# Altium schematic sheet SynchConv_sch.SchDoc: Synchronous Converter
size A4; Author: Matteo Sposito; CompanyName: ePEBBs; Organization: Altium Limited; Address1: L3, 12a Rodborough Rd; Address2: Frenchs Forest; Address3: NSW; Address4: Australia 2086; DocumentNumber: #1; Revision: v0; SheetNumber: 1; SheetTotal: 1
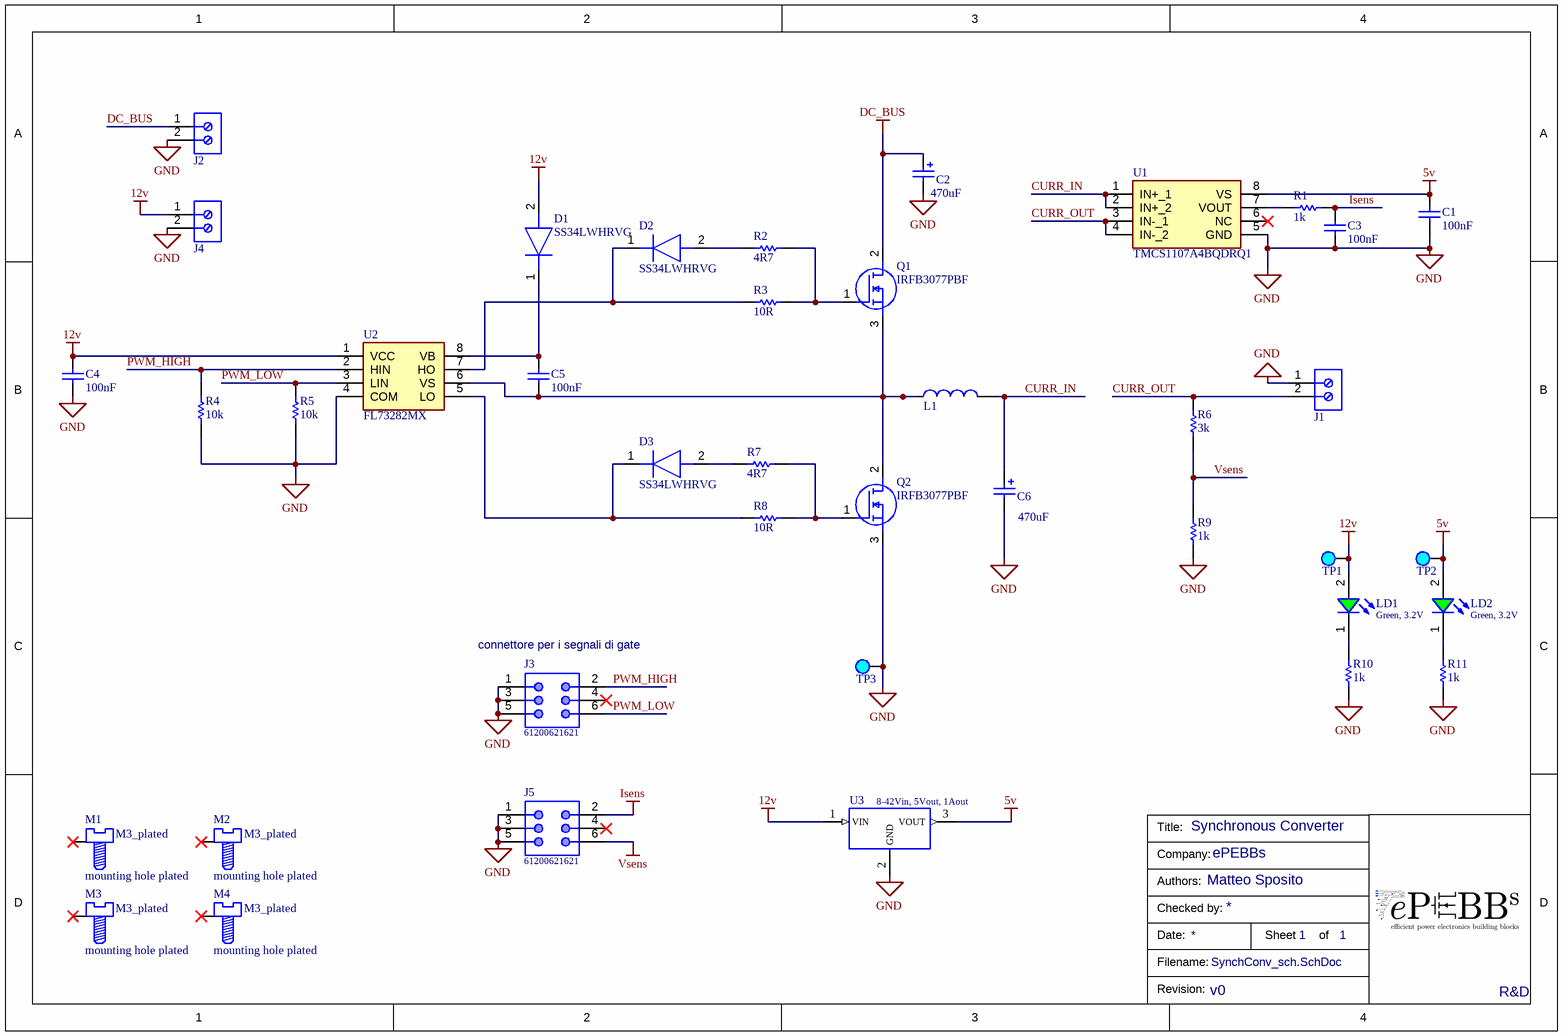
[diagram p0: SynchConv_sch.SchDoc]

## Parts
C1  100nF  [CAP_0805]
C2  470uF  [WCAP-ATG5_D13H20]
C3  100nF  [CAP_0805]
C4  100nF  [CAP_0805]
C5  100nF  [CAP_0805]
C6  470uF  [WCAP-ATG5_D13H20]
D1  SS34LWHRVG  [SODFL3718X102N]
D2  SS34LWHRVG  [SODFL3718X102N]
D3  SS34LWHRVG  [SODFL3718X102N]
J1  691502710002  [691502710002]  (value not drawn)
J2  691502710002  [691502710002]  (value not drawn)
J3  61200621621  [61200621621]
J4  691502710002  [691502710002]  (value not drawn)
J5  61200621621  [61200621621]
L1  59µH, 5.4A  [744134]  (value not drawn)
LD1  Green, 3.2V  [WL-SMCW_0805]
LD2  Green, 3.2V  [WL-SMCW_0805]
M1  mounting hole plated  [M3_Mountingholes plated]
M2  mounting hole plated  [M3_Mountingholes plated]
M3  mounting hole plated  [M3_Mountingholes plated]
M4  mounting hole plated  [M3_Mountingholes plated]
Q1  IRFB3077PBF  [TO254P483X1016X1994-3P]
Q2  IRFB3077PBF  [TO254P483X1016X1994-3P]
R1  1k  [Res_0805]
R2  4R7  [Res_0805]
R3  10R  [Res_0805]
R4  10k  [Res_0805]
R5  10k  [Res_0805]
R6  3k  [Res_0805]
R7  4R7  [Res_0805]
R8  10R  [Res_0805]
R9  1k  [Res_0805]
R10  1k  [Res_0805]
R11  1k  [Res_0805]
TP1  TP_big  [TP_big]  (value not drawn)
TP2  TP_big  [TP_big]  (value not drawn)
TP3  TP_big  [TP_big]  (value not drawn)
U1  TMCS1107A4BQDRQ1  [SOIC127P600X175-8N]
U2  FL73282MX  [SOIC127P600X175-8N]
U3  8-42Vin, 5Vout, 1Aout  [173010x35]

## Nets
5v: C1.2 LD2.2(A) TP2.1 U1.8(VS) U3.3(VOUT)
12v: C4.2 D1.2(A) J4.1 LD1.2(A) TP1.1 U2.1(VCC) U3.1(VIN)
DC_BUS: C2.1(P) J2.1 Q1.2(D)
GND: C1.1 C2.2(N) C3.1 C4.1 C6.2(N) J1.1 J2.2 J3.1 J3.3 J3.5 J4.2 J5.1 J5.3 J5.5 Q2.3(S) R4.1 R5.1 R9.2 R10.1 R11.1 TP3.1 U1.5(GND) U2.4(COM) U3.2(GND)
Isens: C3.2 J5.2 R1.1
Vsens: J5.6 R6.2 R9.1
CURR_IN: C6.1(P) L1.2 U1.1(IN+_1) U1.2(IN+_2)
CURR_OUT: J1.2 R6.1 U1.3(IN-_1) U1.4(IN-_2)
PWM_HIGH: J3.2 R4.2 U2.2(HIN)
PWM_LOW: J3.6 R5.2 U2.3(LIN)
NetC5_1: C5.1 L1.1 Q1.3(S) Q2.2(D) U2.6(VS)
NetC5_2: C5.2 D1.1(K) U2.8(VB)
NetD2_1: D2.1(K) R3.2 U2.7(HO)
NetD2_2: D2.2(A) R2.1
NetD3_1: D3.1(K) R8.2 U2.5(LO)
NetD3_2: D3.2(A) R7.1
NetLD1_1: LD1.1(K) R10.2
NetLD2_1: LD2.1(K) R11.2
NetQ1_1: Q1.1(G) R2.2 R3.1
NetQ2_1: Q2.1(G) R7.2 R8.1
NetR1_2: R1.2 U1.7(VOUT)

Not connected (* = marked no-connect by the designer): J3 4*; J5 4*; M1 1*; M2 1*; M3 1*; M4 1*; U1 6(NC)*

## Notes on the sheet
- (near J3) connettore per i segnali di gate
- Title:
- Checked by:
- Company:
- Authors:
- Date:
- Filename:
- Sheet
- of
- Revision:
- R&D
- (in symbol M3_MountungHole_plated) M3_plated

## Library data of the parts
C1 C3-C5 = Cap_0805: capacitor 0805; Manufacturer Part Number: 885012207098; Manufacturer: Wurth Elektronik; Rated Voltage: 50VDC; Isolation Resistance: >=5GOhm; Ceramic Type: X7R; Capacitance Tolerance: +/-10%; Technical Reference: X7R0805104K050DFCT10000; ComponentLink1Description: Manufacturer; ComponentLink1URL: http://www.we-online.de; ComponentLink2Description: Datasheet; ComponentLink2URL: https://www.we-online.com/catalog/datasheet/885012207098.pdf; Operating Temperature: -55 to +125degC; Packaging: Tape and Reel; Published Date: May 2020; Dissipation Factor: =<2.5%; Height: 0.8mm; Mounting Technology: SMT; Size: 0805; Capacitance: 100nF
C2 C6 = 860020778021: WCAP-ATG5 Aluminum Electrolytic Capacitor, Radial THT, D13xH20mm, 470uF, 63V; Manufacturer: Wurth Elektronik; Capacitance Tolerance: +/-20%; Dissipation Factor: 9%; Endurance: 2000h; Leakage Current: 296.1uA; Ripple Current: 690mA; Technical Reference: ATDI200471M063DSPACB000; ComponentLink1Description: Manufacturer Link; ComponentLink1URL: https://www.we-online.com/redexpert/article/860020778021?ad; ComponentLink2Description: Datasheet; ComponentLink2URL: https://www.we-online.com/redexpert/spec/860020778021?ad; Category: Aluminum Electrolytic Capacitors; Match Code: WCAP-ATG5; Manufacturer Part Number: 860020778021; Mount: Through Hole; Operating Temperature Max: 105°C; Operating Temperature Min: -40°C; Packaging: Ammo Pack; Height: 20mm; Diameter: 13mm; Capacitance: 470uF; Rated Voltage (DC): 63V
D1-D3 = SS34LWHRVG: Diode; Manufacturer_Name: Taiwan Semiconductor; Datasheet Link: https://datasheet.datasheetarchive.com/originals/distributors/DKDS-20/389381.pdf; Height: 1.02mm; Manufacturer_Part_Number: SS34LWHRVG; Mouser Part Number: 821-SS34LWHRVG; Mouser Price/Stock: https://www.mouser.co.uk/ProductDetail/Taiwan-Semiconductor/SS34LWHRVG?qs=5aG0NVq1C4zYvYQjFNyRbA%3D%3D; Arrow Part Number: SS34LWHRVG; Arrow Price/Stock: https://www.arrow.com/en/products/ss34lwhrvg/taiwan-semiconductor?region=nac
J1 J2 J4 = 691502710002: WR-TBL Series 5027 Horizontal Entry Modular, Through Hole, pitch 5mm, 2p; Manufacturer: Wurth Elektronik; Pin Number: 2; Rated Current: 15A; Working Voltage: 300V; PCB/Cable/Panel: PCB; Modularity: Yes; ComponentLink1Description: Manufacturer Link; ComponentLink1URL: https://www.we-online.com/redexpert/article/691502710002?ad; ComponentLink2Description: Datasheet; ComponentLink2URL: https://www.we-online.com/redexpert/spec/691502710002?ad; Category: Terminal Blocks; Match Code: WR-TBL; Manufacturer Part Number: 691502710002; Mount: Through Hole; Operating Temperature Max: 130°C; Operating Temperature Min: -40°C; Packaging: Box; Pitch: 5mm; Orientation: Horizontal; Application: Pressure Clamp
J3 J5 = 61200621621: WR-BHD Box Header, Male PCB side, pitch 2.54mm, THT, Straight, 6p; Manufacturer: Wurth Elektronik; Working Voltage: 250VAC; Withstanding Voltage: 500VAC; Contact Resistance: 20mOhm; Pin Number: 6; Insulation Resistance: 1000MOhm; Rated Current: 3A; ComponentLink1Description: Manufacturer; ComponentLink1URL: http://www.we-online.de; ComponentLink2Description: Datasheet; ComponentLink2URL: https://www.we-online.com/catalog/datasheet/61200621621.pdf; Manufacturer Part Number: 61200621621; Published Date: August 2021; Pitch: 2.54mm; Operating Temperature: -40 to +105degC; Packaging: Tray; Gender: Male PCB side; Mounting Technology: THT; Type: Straight; Length: 15.28mm
L1 = 744134: WE-SI THT Leaded Toroidal Storage Choke, 59µH, 5.4A, 0.05Ω; Manufacturer: Wurth Elektronik; Inductance: 92µH; Saturation Current: 2.3A; Self Resonant Frequency: 9MHz; ComponentLink1Description: Website Link; ComponentLink1URL: https://www.we-online.com/redexpert/article/744134?ad; ComponentLink2Description: Datasheet Link; ComponentLink2URL: https://www.we-online.com/redexpert/spec/744134?ad; Manufacturer Part Number: 744134; Category: Shielded Power Inductors; Match Code: WE-SI; Mount: Through Hole; Operating Temperature Max: 105°C; Operating Temperature Min: -40°C; Packaging: Tray; Length: 31mm; Width: 13.5mm; Height: 31mm; DC Resistance Max: 0.05Ω; Rated Current: 5.4A; Rated Inductance: 59µH
LD1 LD2 = 150080GS75000: WL-SMCW SMT Mono-color Chip LED Waterclear, size 0805, Green, 3.2V, 140deg; Chip Technology: InGaN; Dominant Wavelength typ.: 525nm; Luminous Intensity typ.: 450mcd; Peak Wavelength typ.: 515nm; Viewing Angle: 140deg; ComponentLink1Description: Manufacturer; ComponentLink1URL: http://www.we-online.de; ComponentLink2URL: https://www.we-online.com/catalog/datasheet/150080GS75000.pdf; ComponentLink2Description: Datasheet; Forward Voltage typ.: 3.2V; Emitting Color: Green; Mounting Technology: SMT; Operating Temperature: -40 to +85degC; Published Date: December 2019; Part Number: 150080GS75000; Packaging: Tape and Reel; Size: 0805; Publisher: Wurth Elektronik; Supplier 1: RSComponents; Supplier Part Number 1: 8154221
M1-M4 = M3_MountungHole_plated: M3 plated
Q1 Q2 = IRFB3077PBF: MOSFET (N-Channel); Manufacturer_Name: Infineon; Datasheet Link: http://uk.rs-online.com/web/p/products/6504716; Height: 4.83mm; Manufacturer_Part_Number: IRFB3077PBF; Mouser Part Number: 942-IRFB3077PBF; Mouser Price/Stock: https://www.mouser.co.uk/ProductDetail/Infineon-IR/IRFB3077PBF?qs=9%252BKlkBgLFf2abfAE7SiJEg%3D%3D; Arrow Part Number: IRFB3077PBF; Arrow Price/Stock: https://www.arrow.com/en/products/irfb3077pbf/infineon-technologies-ag
R1-R11 = Res_0805: SMT Thick Film Resistor, size 0805, 0.125W; Tolerance: 1%; Package: 0805
  R1 R9-R11: Value: 1k
  R2 R7: Value: 4R7
  R3 R8: Value: 10R
  R4 R5: Value: 10k
  R6: Value: 3k
TP1-TP3 = TP_big: test point big
U1 = TMCS1107A4BQDRQ1: SENSOR CURRENT HALL 5.6A 8SOIC; Manufacturer_Name: Texas Instruments; Datasheet Link: https://www.ti.com/lit/ds/symlink/tmcs1107-q1.pdf?ts=1634009705469&ref_url=https%253A%252F%252Fwww.ti.com%252Fsitesearch%252Fdocs%252Funiversalsearch.tsp%253FlangPref%253Den-US%2526searchTerm%253DTMCS1107A4UQDRQ1%2526nr%253D2; Height: 1.75mm; Manufacturer_Part_Number: TMCS1107A4BQDRQ1
U2 = FL73282MX: Driver di porta 900V Half-Bridge Gate Driver; Manufacturer_Name: onsemi; Datasheet Link: https://componentsearchengine.com/Datasheets/1/FL73282MX.pdf; Height: 1.75mm; Manufacturer_Part_Number: FL73282MX
U3 = 173010535: MagI3C-FDSM Fixed Step Down Regulator Module, SIP-3, 8-36Vin, 5Vout, 1Aout; Manufacturer Part Number: 173010542; Output Current: 1A; Output Voltage: 5V; Input Voltage: 8-42V; ComponentLink1Description: Manufacturer; ComponentLink1URL: http://www.we-online.de; ComponentLink2Description: Datasheet; ComponentLink2URL: https://www.we-online.com/catalog/datasheet/173010542.pdf; Packaging: Tube; Published Date: March 2020; Mounting Technology: THT; Height: 10.5mm; Length: 11.6mm; Operating Temperature: -40 to +85degC; Publisher: Wurth Elektronik; Size: SIP-3; Width: 8.5mm